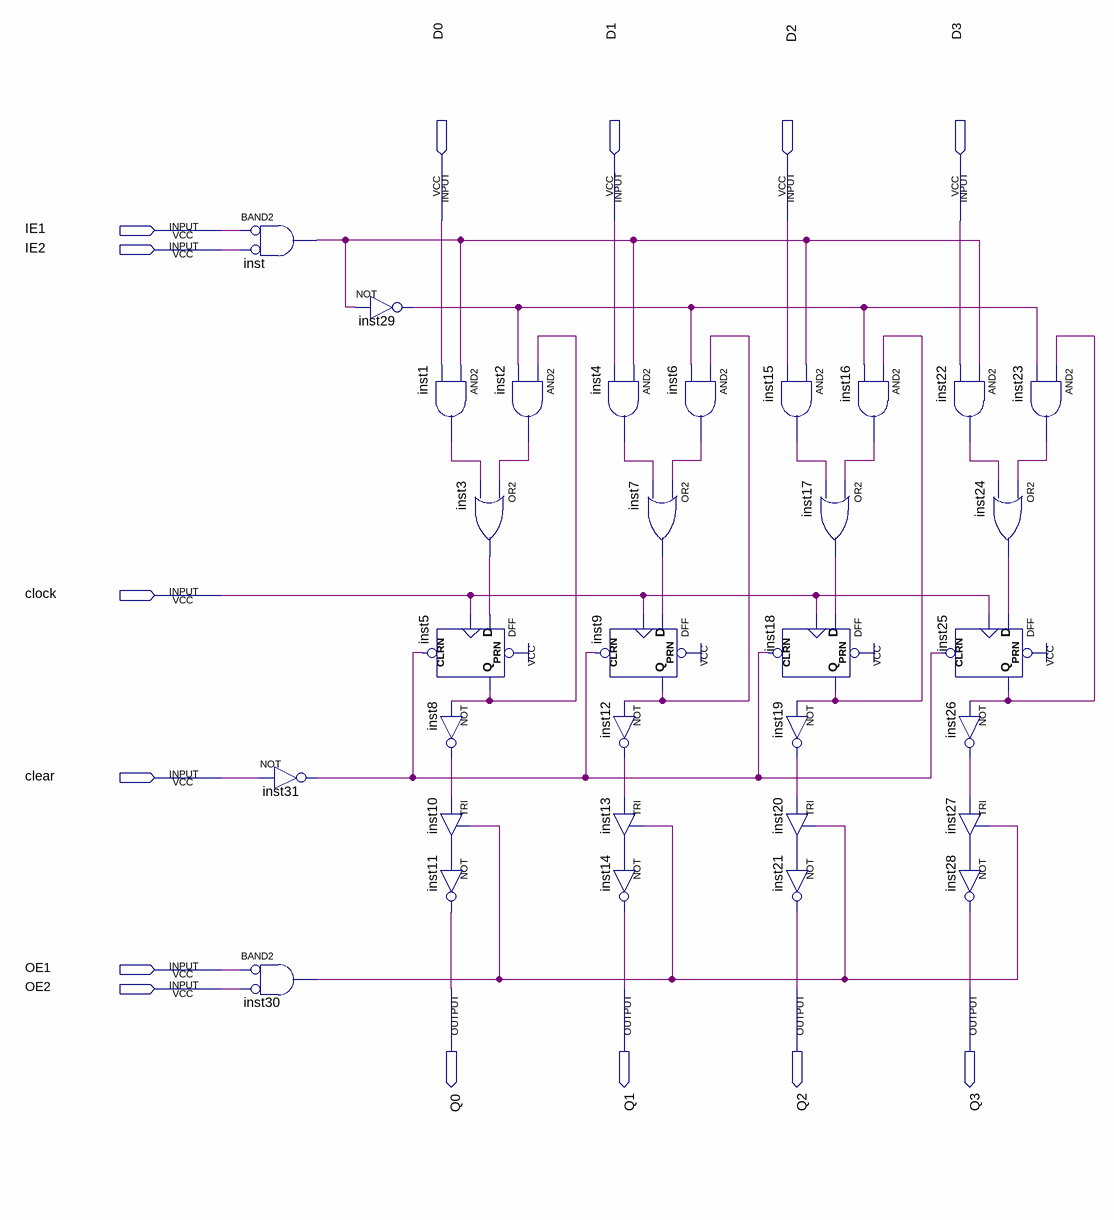
[diagram p0: schematic sheet]
// Quartus schematic ci_74LS173A_lucas.bdf as structural Verilog: 32 symbols, 14 pins
module ci_74LS173A_lucas (
  input  D0,
  input  D1,
  input  D2,
  input  D3,
  input  IE1,
  input  IE2,
  input  clock,
  input  clear,
  input  OE1,
  input  OE2,
  output Q0,
  output Q1,
  output Q2,
  output Q3
);

  wire inst1_out, inst2_out, inst3_out, inst4_out, inst5_q, inst6_out, inst7_out, inst8_out, inst9_q,
       inst10_out, inst12_out, inst13_out, inst15_out, inst16_out, inst17_out, inst18_q, inst19_out,
       inst20_out, inst22_out, inst23_out, inst24_out, inst25_q, inst26_out, inst27_out, inst29_out,
       inst30_out, inst31_out, inst_out;

  and inst (inst_out, ~IE1, ~IE2);  // BAND2
  not inst31 (inst31_out, clear);
  and inst30 (inst30_out, ~OE1, ~OE2);  // BAND2
  not inst29 (inst29_out, inst_out);
  and inst1 (inst1_out, inst_out, D0);
  or inst3 (inst3_out, inst2_out, inst1_out);
  DFF inst5 (.CLRN(inst31_out), .CLK(clock), .D(inst3_out), .PRN(1'b1), .Q(inst5_q));
  not inst8 (inst8_out, inst5_q);
  TRI inst10 (.IN(inst8_out), .OE(inst30_out), .OUT(inst10_out));
  not inst11 (Q0, inst10_out);
  and inst2 (inst2_out, inst5_q, inst29_out);
  and inst4 (inst4_out, inst_out, D1);
  or inst7 (inst7_out, inst6_out, inst4_out);
  DFF inst9 (.CLRN(inst31_out), .CLK(clock), .D(inst7_out), .PRN(1'b1), .Q(inst9_q));
  not inst12 (inst12_out, inst9_q);
  TRI inst13 (.IN(inst12_out), .OE(inst30_out), .OUT(inst13_out));
  not inst14 (Q1, inst13_out);
  and inst6 (inst6_out, inst9_q, inst29_out);
  and inst15 (inst15_out, inst_out, D2);
  DFF inst18 (.CLRN(inst31_out), .CLK(clock), .D(inst17_out), .PRN(1'b1), .Q(inst18_q));
  not inst19 (inst19_out, inst18_q);
  TRI inst20 (.IN(inst19_out), .OE(inst30_out), .OUT(inst20_out));
  not inst21 (Q2, inst20_out);
  and inst16 (inst16_out, inst18_q, inst29_out);
  or inst17 (inst17_out, inst16_out, inst15_out);
  and inst22 (inst22_out, inst_out, D3);
  DFF inst25 (.CLRN(inst31_out), .CLK(clock), .D(inst24_out), .PRN(1'b1), .Q(inst25_q));
  not inst26 (inst26_out, inst25_q);
  TRI inst27 (.IN(inst26_out), .OE(inst30_out), .OUT(inst27_out));
  not inst28 (Q3, inst27_out);
  and inst23 (inst23_out, inst25_q, inst29_out);
  or inst24 (inst24_out, inst23_out, inst22_out);
endmodule
